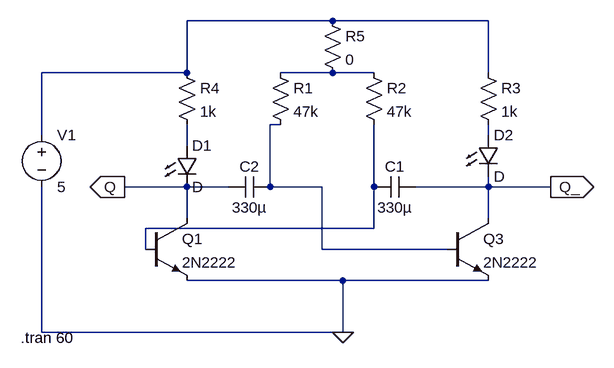
[diagram p0: schematic BJT_astable_multivibrator.asc]
BJT_astable_multivibrator.asc, the LTspice schematic file:
Version 4
SHEET 1 880 680
WIRE 224 -112 0 -112
WIRE 464 -112 224 -112
WIRE 0 -32 0 -112
WIRE 0 -32 -224 -32
WIRE 224 -32 144 -32
WIRE 288 -32 224 -32
WIRE 464 -32 464 -112
WIRE 144 48 128 48
WIRE -224 64 -224 -32
WIRE 464 64 464 48
WIRE 0 80 0 48
WIRE 0 144 -96 144
WIRE 64 144 0 144
WIRE 128 144 128 48
WIRE 208 144 128 144
WIRE 288 144 288 48
WIRE 464 144 464 128
WIRE 464 144 352 144
WIRE 560 144 464 144
WIRE 0 192 0 144
WIRE 464 192 464 144
WIRE 288 208 288 144
WIRE 288 208 -64 208
WIRE -64 240 -64 208
WIRE 208 240 208 144
WIRE 400 240 208 240
WIRE 240 288 0 288
WIRE 464 288 240 288
WIRE -224 368 -224 144
WIRE 240 368 240 288
WIRE 240 368 -224 368
FLAG 560 144 Q_
IOPIN 560 144 Out
FLAG 240 368 0
FLAG -96 144 Q
IOPIN -96 144 Out
SYMBOL npn -64 192 R0
SYMATTR InstName Q1
SYMATTR Value 2N2222
SYMBOL cap 352 128 R90
WINDOW 0 0 32 VBottom 2
WINDOW 3 32 32 VTop 2
SYMATTR InstName C1
SYMATTR Value 330µ
SYMBOL cap 128 128 R90
WINDOW 0 0 32 VBottom 2
WINDOW 3 32 32 VTop 2
SYMATTR InstName C2
SYMATTR Value 330µ
SYMBOL res 128 -48 R0
SYMATTR InstName R1
SYMATTR Value 47k
SYMBOL res 272 -48 R0
SYMATTR InstName R2
SYMATTR Value 47k
SYMBOL res 448 -48 R0
SYMATTR InstName R3
SYMATTR Value 1k
SYMBOL res -16 -48 R0
SYMATTR InstName R4
SYMATTR Value 1k
SYMBOL npn 400 192 R0
SYMATTR InstName Q3
SYMATTR Value 2N2222
SYMBOL voltage -224 48 R0
WINDOW 123 0 0 Left 0
WINDOW 39 0 0 Left 0
SYMATTR InstName V1
SYMATTR Value 5
SYMBOL LED -16 80 R0
SYMATTR InstName D1
SYMBOL LED 448 64 R0
SYMATTR InstName D2
SYMBOL res 208 -128 R0
SYMATTR InstName R5
SYMATTR Value 0
TEXT -256 376 Left 2 !.tran 60

The netlist it stands for:
* BJT_astable_multivibrator.asc
Q1 Q N006 0 0 2N2222
C1 Q_ N006 330µ
C2 N003 Q 330µ
R1 N002 N003 47k
R2 N002 N006 47k
R3 N001 N004 1k
R4 N001 N005 1k
Q3 Q_ N003 0 0 2N2222
V1 N001 0 5
D1 N005 Q D
D2 N004 Q_ D
R5 N001 N002 0
.model D D
.lib standard.dio
.model NPN NPN
.model PNP PNP
.lib standard.bjt
.tran 60
.backanno
.end